# Altium schematic sheet uC.SCHDOC
size A4; DocumentNumber: 4; SheetNumber: 4; SheetTotal: 6
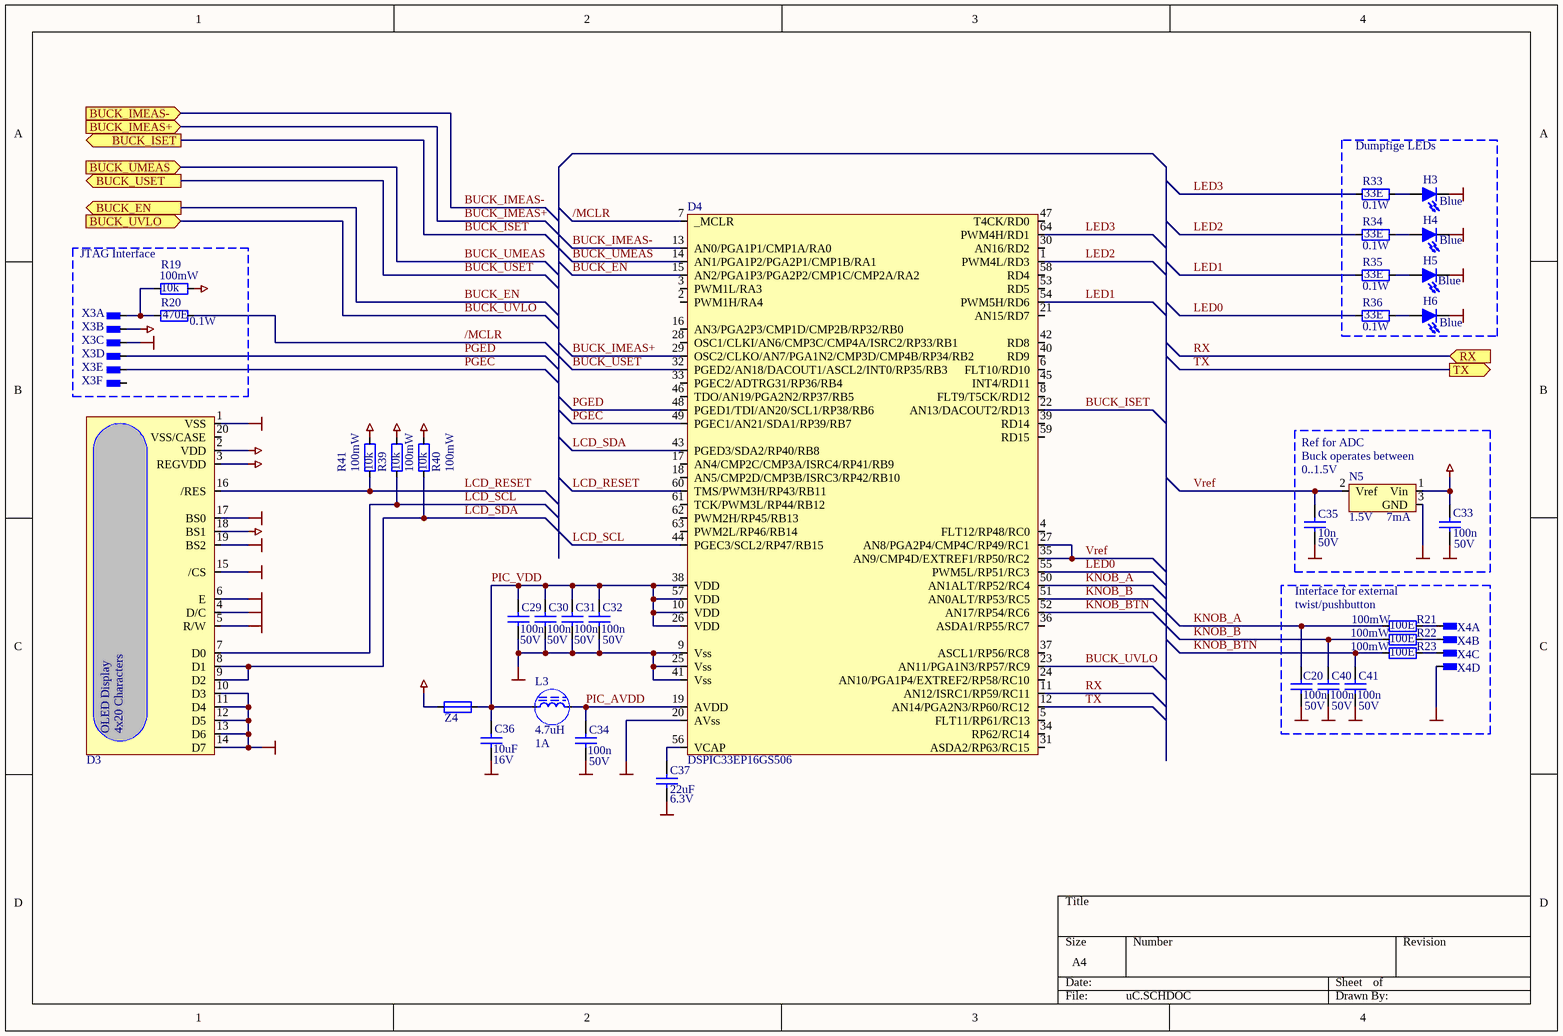
[diagram p0: uC.SCHDOC]

## Parts
C20  value 100n  Value2: 50V  [SMD_0603]  (hidden comment: C_SMD_CER_100N_50V_10%_X7R_0603)
C29  value 100n  Value2: 50V  [SMD_0603]  (hidden comment: C_SMD_CER_100N_50V_10%_X7R_0603)
C30  value 100n  Value2: 50V  [SMD_0603]  (hidden comment: C_SMD_CER_100N_50V_10%_X7R_0603)
C31  value 100n  Value2: 50V  [SMD_0603]  (hidden comment: C_SMD_CER_100N_50V_10%_X7R_0603)
C32  value 100n  Value2: 50V  [SMD_0603]  (hidden comment: C_SMD_CER_100N_50V_10%_X7R_0603)
C33  value 100n  Value2: 50V  [SMD_0603]  (hidden comment: C_SMD_CER_100N_50V_10%_X7R_0603)
C34  value 100n  Value2: 50V  [SMD_0603]  (hidden comment: C_SMD_CER_100N_50V_10%_X7R_0603)
C35  value 10n  Value2: 50V  [SMD_0603]  (hidden comment: C_SMD_CER_10N_50V_10%_X7R_0603)
C36  value 10uF  Value2: 16V  [SMD_0805]  (hidden comment: C_SMD_CER_10U_16V_10%_X5R_0805)
C37  value 22uF  Value2: 6.3V  [SMD_1206]  (hidden comment: C_SMD_CER_22U_6V3_20%_X5R_1206)
C40  value 100n  Value2: 50V  [SMD_0603]  (hidden comment: C_SMD_CER_100N_50V_10%_X7R_0603)
C41  value 100n  Value2: 50V  [SMD_0603]  (hidden comment: C_SMD_CER_100N_50V_10%_X7R_0603)
D3  D_LCD_80CHAR_20X4_NHD-0420CW-AR3  [THT_CON_P2.54_D0.9_2X10]  (value not drawn)
D4  Type: DSPIC33EP16GS506  [SMD_TQFP-64]  (hidden comment: D_DSPIC33EP16GS506_TQFP-64)
H3  Type: Blue  [SMD_0603P]  (hidden comment: H_SMD_LED_BLUE_0603)
H4  Type: Blue  [SMD_0603P]  (hidden comment: H_SMD_LED_BLUE_0603)
H5  Type: Blue  [SMD_0603P]  (hidden comment: H_SMD_LED_BLUE_0603)
H6  Type: Blue  [SMD_0603P]  (hidden comment: H_SMD_LED_BLUE_0603)
L3  value 4.7uH  Value2: 1A  [SMD_0806]  (hidden comment: L_SMD_4U7_1A_20%_0806)
N5  value 1.5V  Value2: 7mA  [SMD_SOT_23_3]  (hidden comment: N_UREF_1V5_0A007_52UVRMS_ISL21080CIH315Z_SOT-23-3)
R19  value 10k  Value2: 100mW  [SMD_0603]  (hidden comment: R_SMD_THINFILM_10K_0W1_1%_50PPM_0603)
R20  value 470E  Value2: 0.1W  [SMD_0603]  (hidden comment: R_SMD_THINFILM_470E_0W1_1%_50PPM_0603)
R21  value 100E  Value2: 100mW  [SMD_0603]  (hidden comment: R_SMD_THINFILM_100E_0W1_1%_50PPM_0603)
R22  value 100E  Value2: 100mW  [SMD_0603]  (hidden comment: R_SMD_THINFILM_100E_0W1_1%_50PPM_0603)
R23  value 100E  Value2: 100mW  [SMD_0603]  (hidden comment: R_SMD_THINFILM_100E_0W1_1%_50PPM_0603)
R33  value 33E  Value2: 0.1W  [SMD_0603]  (hidden comment: R_SMD_THINFILM_33E_0W1_1%_50PPM_0603)
R34  value 33E  Value2: 0.1W  [SMD_0603]  (hidden comment: R_SMD_THINFILM_33E_0W1_1%_50PPM_0603)
R35  value 33E  Value2: 0.1W  [SMD_0603]  (hidden comment: R_SMD_THINFILM_33E_0W1_1%_50PPM_0603)
R36  value 33E  Value2: 0.1W  [SMD_0603]  (hidden comment: R_SMD_THINFILM_33E_0W1_1%_50PPM_0603)
R39  value 10k  Value2: 100mW  [SMD_0603]  (hidden comment: R_SMD_THINFILM_10K_0W1_1%_50PPM_0603)
R40  value 10k  Value2: 100mW  [SMD_0603]  (hidden comment: R_SMD_THINFILM_10K_0W1_1%_50PPM_0603)
R41  value 10k  Value2: 100mW  [SMD_0603]  (hidden comment: R_SMD_THINFILM_10K_0W1_1%_50PPM_0603)
X3  X_CONNECTOR_P2.54_D0.9_1X6  [THT_CON_P2.54_D0.9_1X6]  (value not drawn)  (parts A,B,C,D,E,F of 6)
X4  X_CONNECTOR_P2.54_D0.9_1X4  [THT_CON_P2.54_D0.9_1X4]  (value not drawn)  (parts A,B,C,D of 4)
Z4  Z_SMD_FERRITE_1A5_470E@100MHZ_0603  [SMD_0603]  (value not drawn)

## Blocks framed on the sheet
Dumpfige LEDs: H3-H6 R33-R36
JTAG Interface: R19 R20 X3

## Ports
BUCK_EN (out), BUCK_IMEAS+ (in), BUCK_IMEAS- (in), BUCK_ISET (out), BUCK_UMEAS (in), BUCK_USET (out), BUCK_UVLO (in), RX (in), TX (out)

## Nets
+3.3V: C33.2 N5.1(Vin) R19.2 X3.2 Z4.2
+5V: D3.2(VDD) D3.3(REGVDD) D3.18(BS1) R39.2 R40.2 R41.2
GND: C20.1 C29.1 C30.1 C31.1 C32.1 C33.1 C34.1 C35.1 C36.1 C37.1 C40.1 C41.1 D3.1(VSS) D3.4(D/C) D3.5(R/W) D3.6(E) D3.10(D3) D3.11(D4) D3.12(D5) D3.13(D6) D3.14(D7) D3.15(/CS) D3.17(BS0) D3.19(BS2) D4.9(Vss) D4.20(AVss) D4.25(Vss) D4.41(Vss) H3.2 H4.2 H5.2 H6.2 N5.3(GND) X3.3 X4.4
/MCLR: D4.7(_MCLR) R20.2
BUCK_EN: D4.15(AN2/PGA1P3/PGA2P2/CMP1C/CMP2A/RA2) ; port BUCK_EN
BUCK_IMEAS+: D4.29(OSC2/CLKO/AN7/PGA1N2/CMP3D/CMP4B/RP34/RB2) ; port BUCK_IMEAS+
BUCK_IMEAS-: D4.13(AN0/PGA1P1/CMP1A/RA0) ; port BUCK_IMEAS-
BUCK_ISET: D4.22(AN13/DACOUT2/RD13) ; port BUCK_ISET
BUCK_UMEAS: D4.14(AN1/PGA1P2/PGA2P1/CMP1B/RA1) ; port BUCK_UMEAS
BUCK_USET: D4.32(PGED2/AN18/DACOUT1/ASCL2/INT0/RP35/RB3) ; port BUCK_USET
BUCK_UVLO: D4.23(AN11/PGA1N3/RP57/RC9) ; port BUCK_UVLO
KNOB_A: C20.2 D4.50(AN1ALT/RP52/RC4) R21.1
KNOB_B: C40.2 D4.51(AN0ALT/RP53/RC5) R22.1
KNOB_BTN: C41.2 D4.52(AN17/RP54/RC6) R23.1
LCD_RESET: D3.16(/RES) D4.60(TMS/PWM3H/RP43/RB11) R41.1
LCD_SCL: D3.7(D0) D4.44(PGEC3/SCL2/RP47/RB15) R39.1
LCD_SDA: D3.8(D1) D3.9(D2) D4.43(PGED3/SDA2/RP40/RB8) R40.1
LED0: D4.55(PWM5L/RP51/RC3) R36.1
LED1: D4.54(PWM5H/RD6) R35.1
LED2: D4.1(PWM4L/RD3) R34.1
LED3: D4.64(PWM4H/RD1) R33.1
PGEC: D4.49(PGEC1/AN21/SDA1/RP39/RB7) X3.5
PGED: D4.48(PGED1/TDI/AN20/SCL1/RP38/RB6) X3.4
PIC_AVDD: C34.2 D4.19(AVDD) L3.2
PIC_VDD: C29.2 C30.2 C31.2 C32.2 C36.2 D4.10(VDD) D4.26(VDD) D4.38(VDD) D4.57(VDD) L3.1 Z4.1
RX: D4.11(AN12/ISRC1/RP59/RC11) ; port RX
TX: D4.12(AN14/PGA2N3/RP60/RC12) ; port TX
Vref: C35.2 D4.27(AN8/PGA2P4/CMP4C/RP49/RC1) D4.35(AN9/CMP4D/EXTREF1/RP50/RC2) N5.2(Vref)
NetC37_2: C37.2 D4.56(VCAP)
NetH3_1: H3.1 R33.2
NetH4_1: H4.1 R34.2
NetH5_1: H5.1 R35.2
NetH6_1: H6.1 R36.2
NetR19_1: R19.1 R20.1 X3.1
NetR21_2: R21.2 X4.1
NetR22_2: R22.2 X4.2
NetR23_2: R23.2 X4.3

Not connected (* = marked no-connect by the designer): D3 20(VSS/CASE); D4 2(PWM1H/RA4) 3(PWM1L/RA3) 4(FLT12/RP48/RC0) 5(FLT11/RP61/RC13) 6(FLT10/RD10) 8(FLT9/T5CK/RD12) 16(AN3/PGA2P3/CMP1D/CMP2B/RP32/RB0) 17(AN4/CMP2C/CMP3A/ISRC4/RP41/RB9) 18(AN5/CMP2D/CMP3B/ISRC3/RP42/RB10) 21(AN15/RD7) 24(AN10/PGA1P4/EXTREF2/RP58/RC10) 28(OSC1/CLKI/AN6/CMP3C/CMP4A/ISRC2/RP33/RB1) 30(AN16/RD2) 31(ASDA2/RP63/RC15) 33(PGEC2/ADTRG31/RP36/RB4) 34(RP62/RC14) 36(ASDA1/RP55/RC7) 37(ASCL1/RP56/RC8) 39(RD14) 40(RD9) 42(RD8) 45(INT4/RD11) 46(TDO/AN19/PGA2N2/RP37/RB5) 47(T4CK/RD0) 53(RD5) 58(RD4) 59(RD15) 61(TCK/PWM3L/RP44/RB12) 62(PWM2H/RP45/RB13) 63(PWM2L/RP46/RB14); X3 6

## Notes on the sheet
- (near N5) Ref for ADC
- (near N5) Buck operates between
- (near N5) 0..1.5V
- Interface for external
- (near R21) twist/pushbutton
- (in symbol D_LCD_80CHAR_20X4_NHD-0420CW-AR3) OLED Display; 4x20 Characters

## Library data of the parts
C20 C29-C34 C40 C41 = C_SMD_CER_100N_50V_10%_X7R_0603: SMD Capacitor; Supplier - E+H-flowtec SAP: 50092748; Supplier - Digikey: 1276-1936-1-ND
C35 = C_SMD_CER_10N_50V_10%_X7R_0603: SMD Capacitor; Supplier - E+H-flowtec SAP: 50092743; Supplier - Digikey: 399-1091-1-ND
C36 = C_SMD_CER_10U_16V_10%_X5R_0805: SMD Capacitor; Supplier - E+H-flowtec SAP: 71107344; Supplier - Digikey: 490-6473-1-ND
C37 = C_SMD_CER_22U_6V3_20%_X5R_1206: SMD Capacitor; Supplier - E+H-flowtec SAP: 71128390; Supplier - Digikey: 587-3398-1-ND
H3-H6 = H_SMD_LED_BLUE_0603: Blue LED, 5mA; Supplier - Digikey: VAOL-S6SB4CT-ND
L3 = L_SMD_4U7_1A_20%_0806: SMD Inductor; Supplier - Digikey: 732-2956-1-ND
R19 R39-R41 = R_SMD_THINFILM_10K_0W1_1%_50PPM_0603: SMD Resistor; Supplier - E+H-flowtec SAP: 50092700; Supplier - Digikey: YAG2321CT-ND
R20 = R_SMD_THINFILM_470E_0W1_1%_50PPM_0603: SMD Resistor; Supplier - E+H-flowtec SAP: 50092681
R21-R23 = R_SMD_THINFILM_100E_0W1_1%_50PPM_0603: SMD Resistor; Supplier - E+H-flowtec SAP: 50092674; Supplier - Digikey: YAG2128CT-ND
R33-R36 = R_SMD_THINFILM_33E_0W1_1%_50PPM_0603: SMD Resistor; Supplier - E+H-flowtec SAP: 50092668; Supplier - Digikey: MCT0603-33.0-CFCT-ND
X3 = X_CONNECTOR_P2.54_D0.9_1X6: Pitch 2.54, Diameter 0.9mm, 1 row, 6 columns; Type: Pitch 2.54, Diameter 0.9mm, 1 row, 3 columns
X4 = X_CONNECTOR_P2.54_D0.9_1X4: Pitch 2.54, Diameter 0.9mm, 1 row, 4 columns; Type: Pitch 2.54, Diameter 0.9mm, 1 row, 3 columns
Z4 = Z_SMD_FERRITE_1A5_470E@100MHZ_0603: FERRITE CHIP 470 OHM 1500MA 0603; Value: 1.5A; Supplier - Digikey: 490-5257-1-ND; Type: BLM18KG471SN1D
D3 = D_LCD_80CHAR_20X4_NHD-0420CW-AR3: Supplier - Digikey: NHD-0420CW-AR3-ND
D4 = D_DSPIC33EP16GS506_TQFP-64: Supplier - Digikey: DSPIC33EP16GS506-I/PT-ND
N5 = N_UREF_1V5_0A007_52UVRMS_ISL21080CIH315Z_SOT-23-3: Supplier - Digikey: ISL21080CIH315Z-TKCT-ND; Type: ISL21080CIH315Z-TK